# EAGLE design iotchair_nano-shield (EAGLE 6.5.0)
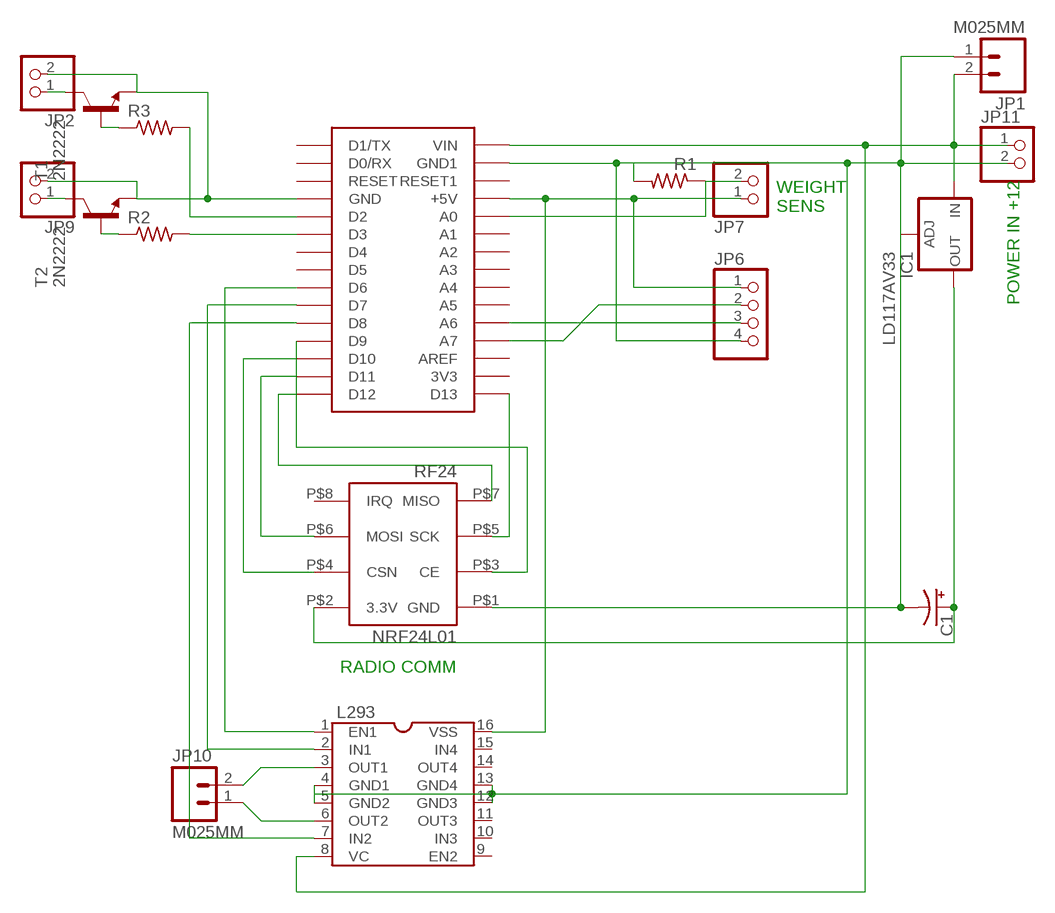
[diagram p0: schematic, sheet 1]

## Parts
C1  CPOL-USTT2D6L  [TT2D6L]
IC1  LD117AV33  [TO220L1]
JP1  M025MM  [SCREWTERMINAL-5MM-2]
JP2  PINHD-1X2  [1X02]
JP6  PINHD-1X4  [1X04]
JP7  PINHD-1X2  [1X02]
JP9  PINHD-1X2  [1X02]
JP10  M025MM  [SCREWTERMINAL-5MM-2]
JP11  PINHD-1X2  [1X02]
L293  DIL16  [DIL16]
NRF24L01  RF24  [4X2HEADER]
R1  R-US_0204/5  [0204/5]
R2  R-US_0204/5  [0204/5]
R3  R-US_0204/5  [0204/5]
T1  2N2222  [TO92-EBC-OVAL]
T2  2N2222  [TO92-EBC-OVAL]
U$1  ARDUINONANO  [PDIP-32]

## Nets
N$1: L293.2(IN1) U$1.D7
N$2: C1.+ IC1.2(OUT) NRF24L01.P$2(3.3V)
N$3: JP9.1 T2.C
N$4: JP6.3 U$1.A6
N$5: JP7.2 R1.1 U$1.A0
N$6: IC1.3(IN) JP1.2 JP11.1 L293.8(VC) U$1.VIN
N$7: JP6.2 U$1.A7
N$8: JP10.1 L293.6(OUT2)
N$18: NRF24L01.P$5(SCK) U$1.D13
N$19: NRF24L01.P$7(MISO) U$1.D12
N$20: NRF24L01.P$6(MOSI) U$1.D11
N$21: NRF24L01.P$4(CSN) U$1.D10
N$22: NRF24L01.P$3(CE) U$1.D9
N$24: L293.1(EN1) U$1.D6
N$25: C1.- IC1.1(ADJ) JP1.1 JP6.4 JP11.2 L293.4(GND1) L293.5(GND2) L293.12(GND3) L293.13(GND4) NRF24L01.P$1(GND) R1.2 U$1.GND1
N$26: R2.2 U$1.D3
N$27: L293.7(IN2) U$1.D8
N$28: R3.1 T1.B
N$29: JP2.1 T1.C
N$30: JP2.2 JP9.2 T1.E T2.E U$1.GND
N$31: R3.2 U$1.D2
N$33: JP6.1 JP7.1 L293.16(VSS) U$1.+5V
N$39: R2.1 T2.B
N$40: JP10.2 L293.3(OUT1)
Unconnected: L293.9(EN2) L293.10(IN3) L293.11(OUT3) L293.14(OUT4) L293.15(IN4) NRF24L01.P$8(IRQ) U$1.3V3 U$1.A1 U$1.A2 U$1.A3 U$1.A4 U$1.A5 U$1.AREF U$1.D0/RX U$1.D1/TX U$1.D4 U$1.D5 U$1.RESET U$1.RESET1

## Notes on the sheet
- WEIGHT
  SENS
- POWER IN +12
- RADIO COMM

## Library data of the parts
C1 = adafruit:CPOL-US: POLARIZED CAPACITOR, American symbol
IC1 = v-reg:LD117A?*: Low drop fixed and adjustable positive voltage regulators 1 A Source: http://www.st.com/stonline/products/literature/ds/7194/ld1117axx.pdf
JP1 JP10 = SparkFun-Connectors:M02: Standard 2-pin 0.1" header. Use with - straight break away headers ( PRT-00116) - right angle break away headers (PRT-00553) - swiss pins (PRT-00743) - machine pins (PRT-00117) - female headers (PRT-00115) Molex polarized connector foot print use with: PRT-08233 with associated crimp pins and housings. 2.54_SCREWTERM for use with PRT-10571. 3.5mm Screw Terminal footprints for PRT-08084 5mm Screw Terminal footprints for use with PRT-08432; STOREFRONT_ID: PRT-08432
JP2 JP7 JP9 JP11 = pinhead:PINHD-1X2: PIN HEADER
JP6 = pinhead:PINHD-1X4: PIN HEADER
L293 = l293:DIL16: Dual In Line / Socket
NRF24L01 = rf24:RF24
R1-R3 = adafruit:R-US_: RESISTOR, American symbol
T1 T2 = adafruit:2N2222: NPN TRANSISTOR Big oval pads
U$1 = jet-lib:ARDUINONANO

## Board
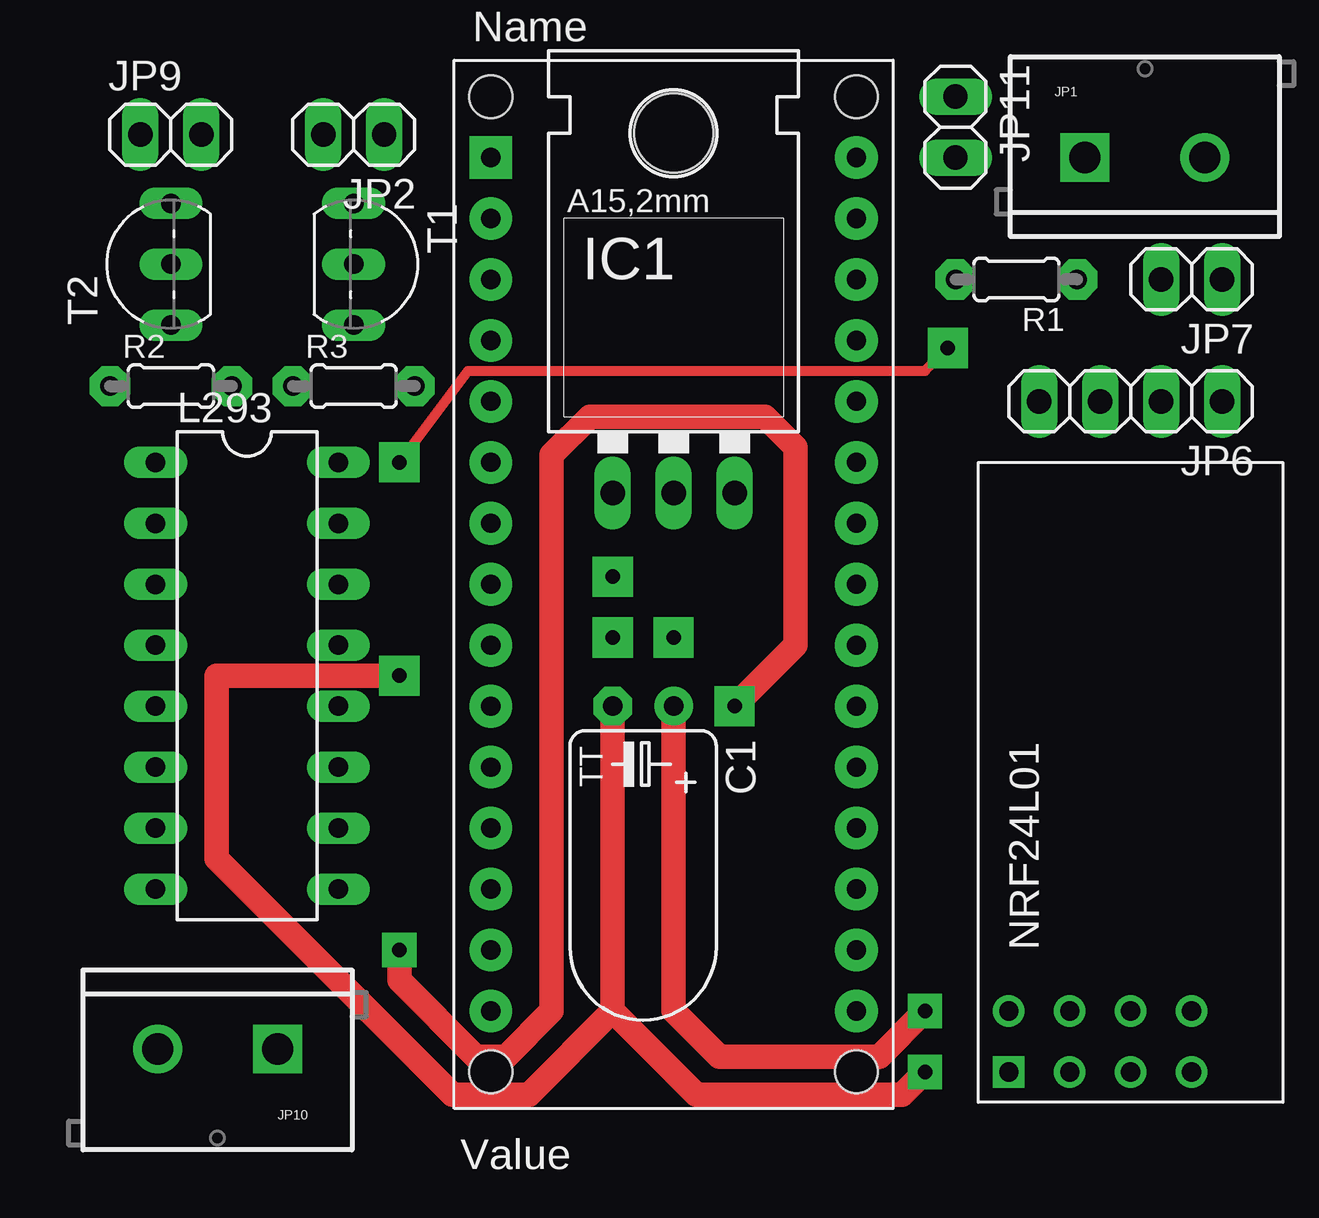
[diagram p1: board, top side]
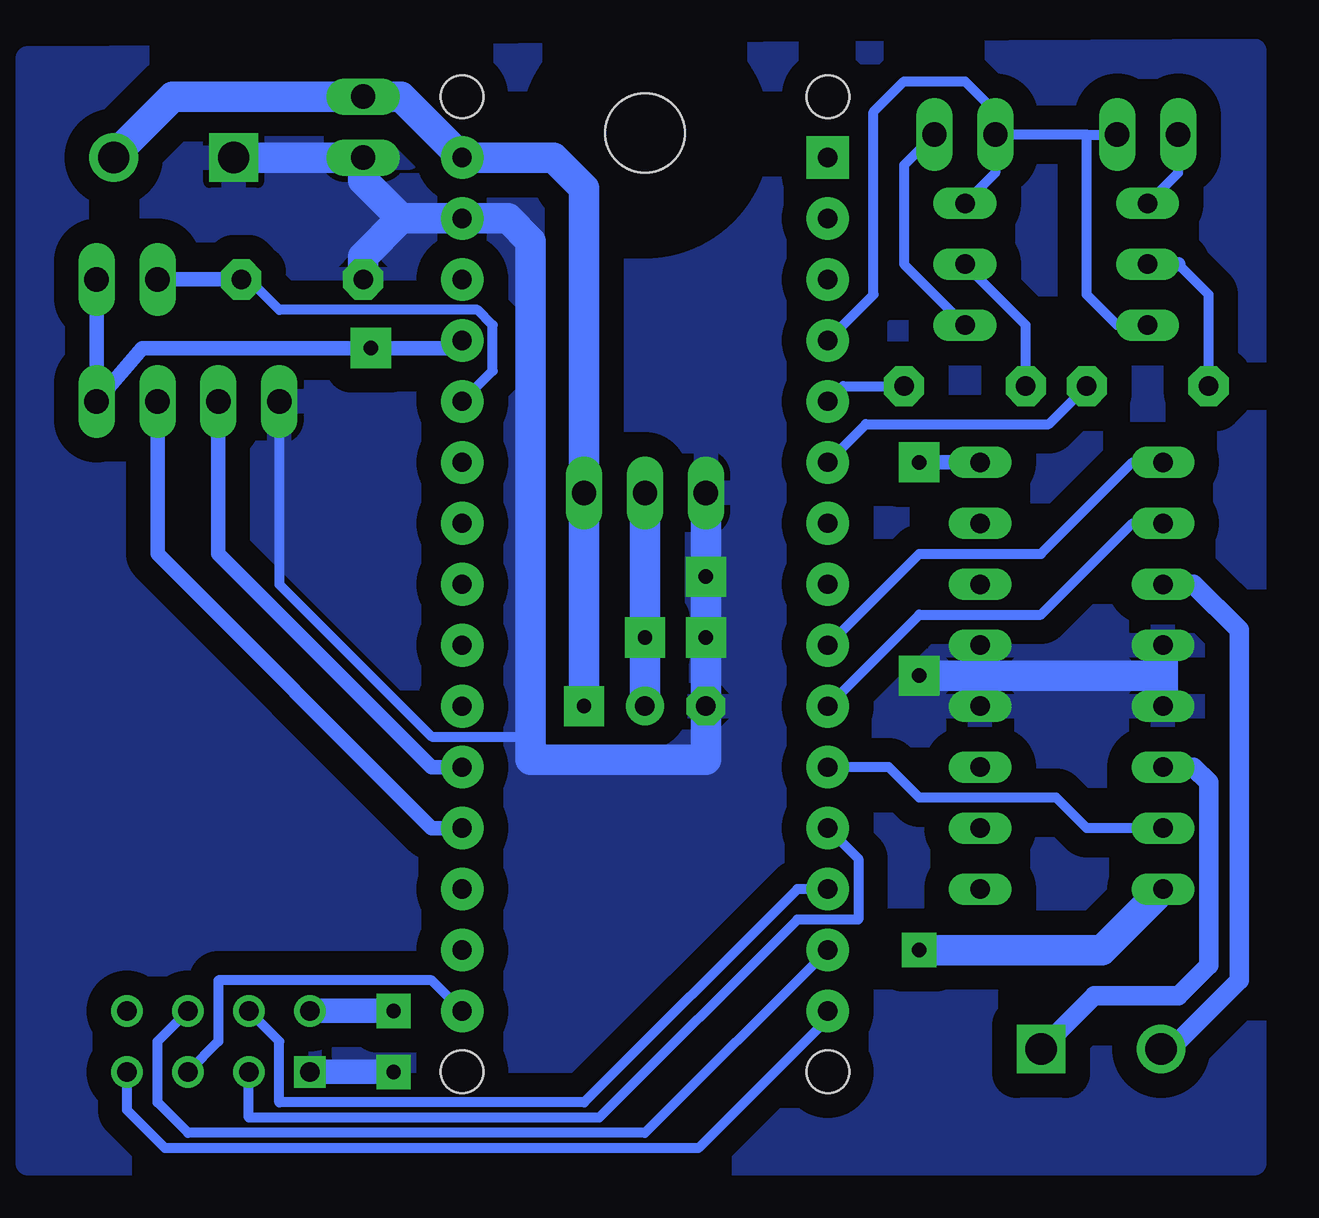
[diagram p2: board, bottom side, seen from below]

No outline drawn. Coordinates in mm, seen from the top.
Copper layers (1*16): Top 0.035mm / dielectric 1.5mm / Bottom 0.035mm
Design rules "default": minimum track width 10mil, minimum drill 24mil, track to track 8mil, track to pad 8mil, pad to pad 8mil, via to via 8mil, smd to smd 8mil, copper to edge 40mil, drill to drill 8mil, minimum pad ring 10mil, minimum via ring 8mil, stop-mask expansion 4mil, vias tented up to drill 0mil, thermal gap 10mil

### Footprints (pad centres in the part's own frame; a part is rotated, then mirrored left to right if it is on the bottom)
TT2D6L = drill 0.813 pad 1.6: + -1.27,0 | drill 0.813 pad 1.6 octagon: - 1.27,0
TO220L1 = drill 1.016 long: 1 -2.54,-3.81; 2 0,-3.81; 3 2.54,-3.81 | hole 3.302: 0,11.176
SCREWTERMINAL-5MM-2 = drill 1.3 pad 2.032 square: 1 0,0 | drill 1.3 pad 2.032: 2 5,0
1X02 = drill 1.016 long: 1 -1.27,0; 2 1.27,0
1X04 = drill 1.016 long: 1 -3.81,0; 2 -1.27,0; 3 1.27,0; 4 3.81,0
DIL16 = drill 0.813 long: 1 -8.89,-3.81; 2 -6.35,-3.81; 3 -3.81,-3.81; 4 -1.27,-3.81; 5 1.27,-3.81; 6 3.81,-3.81; 7 6.35,-3.81; 8 8.89,-3.81; 9 8.89,3.81; 10 6.35,3.81; 11 3.81,3.81; 12 1.27,3.81; 13 -1.27,3.81; 14 -3.81,3.81; 15 -6.35,3.81; 16 -8.89,3.81
4X2HEADER = drill 0.8 square: P$1 -1.27,3.81 | drill 0.8: P$2 1.27,3.81; P$3 -1.27,1.27; P$4 1.27,1.27; P$5 -1.27,-1.27; P$6 1.27,-1.27; P$7 -1.27,-3.81; P$8 1.27,-3.81
0204/5 = drill 0.813 pad 1.676 octagon: 1 -2.54,0; 2 2.54,0
TO92-EBC-OVAL = drill 0.813 long: B 0,-1.27; C 2.54,-1.27; E -2.54,-1.27
PDIP-32 = drill 0.8 pad 1.778: 3V3 15.24,-35.56; +5V 15.24,-10.16; A0 15.24,-12.7; A1 15.24,-15.24; A2 15.24,-17.78; A3 15.24,-20.32; A4 15.24,-22.86; A5 15.24,-25.4; A6 15.24,-27.94; A7 15.24,-30.48; AREF 15.24,-33.02; D0/RX 0,-5.08; D2 0,-12.7; D3 0,-15.24; D4 0,-17.78; D5 0,-20.32; D6 0,-22.86; D7 0,-25.4; D8 0,-27.94; D9 0,-30.48; D10 0,-33.02; D11 0,-35.56; D12 0,-38.1; D13 15.24,-38.1; GND 0,-10.16; GND1 15.24,-5.08; RESET 0,-7.62; RESET1 15.24,-7.62; VIN 15.24,-2.54 | drill 0.8 pad 1.778 square: D1/TX 0,-2.54 | hole 1.778: 0,0; 0,-40.64; 15.24,-40.64; 15.24,0

### Placement (x,y rotation side)
C1  24.13,19.05 180 top
IC1  25.4,31.75 0 top
JP1  42.55,41.91 0 top
JP2  12.06,42.86 180 top
JP6  44.45,31.75 180 top
JP7  46.99,36.83 180 top
JP9  4.45,42.86 0 top
JP10  8.89,4.76 180 top
JP11  37.15,43.18 270 top
L293  7.62,20.32 270 top
NRF24L01  43.18,5.08 90 top
R1  39.69,36.83 180 top
R2  4.45,32.38 0 top
R3  12.06,32.38 0 top
T1  13.34,37.47 270 top
T2  3.17,37.47 90 top
U$1  17.78,44.45 0 top

### Tracks (layer width: path | path; a pad name or v marks a point on that pad's centre or on a via)
N$1
  Bottom 0.406: U$1.D7 13.97,22.86 8.89,22.86 5.08,26.67 L293.2
N$2  (via drill 0.6, 0.6 pad 1.42, 0.6 pad 1.68)
  Top 1.016: C1.+ 25.4,6.35 27.3,4.45 33.97,4.45 v35.88,6.35
  Bottom 1.016: v35.88,6.35 NRF24L01.P$2
  Bottom 1.27: IC1.2 v25.4,21.91 C1.+
  other vias: 25.4,19.05
N$3
  Bottom 0.406: T2.C 3.17,41.27 JP9.1
N$4
  Bottom 0.61: U$1.A6 34.29,16.51 43.18,25.4 JP6.3
N$5
  Bottom 0.254: 41.91,36.83 R1.1
  Bottom 0.406: U$1.A0 31.75,33.02 31.75,34.92 32.38,35.56 40.64,35.56 41.91,36.83
  Bottom 0.61: R1.1 JP7.2
N$6  (via drill 0.6 pad 1.42, 0.6 pad 1.68)
  Top 1.016: v27.94,19.05 30.48,21.59 30.48,29.84 29.21,31.11 21.91,31.11 20.32,29.53 20.32,6.35 18.41,4.45 17.14,4.45 13.97,7.62 v13.97,8.89
  Bottom 1.27: JP1.2 47.55,41.99 45.09,44.45 JP11.1 35.56,44.45 U$1.VIN 29.21,41.91 27.94,40.64 IC1.3 v27.94,19.05 | L293.8 6.35,8.89 v13.97,8.89
N$7
  Bottom 0.61: U$1.A7 34.29,13.97 45.72,25.4 JP6.2
N$8
  Bottom 0.813: JP10.1 6.67,6.99 3.17,6.99 1.91,8.26 1.91,15.88 2.54,16.51 L293.6
N$18
  Bottom 0.406: NRF24L01.P$5 43.18,5.08 43.18,7.62 34.29,7.62 U$1.D13
N$19
  Bottom 0.406: U$1.D12 17.78,6.03 23.18,0.64 45.4,0.64 46.99,2.22 NRF24L01.P$7
N$20
  Bottom 0.406: NRF24L01.P$6 45.72,5.08 45.72,2.54 44.45,1.27 25.4,1.27 U$1.D11
N$21
  Bottom 0.406: NRF24L01.P$4 40.64,5.08 40.64,2.54 27.94,2.54 19.05,11.43 U$1.D10
N$22
  Bottom 0.406: NRF24L01.P$3 41.91,1.91 27.3,1.91 19.05,10.16 16.51,10.16 16.51,12.7 U$1.D9
N$24
  Bottom 0.406: U$1.D6 13.97,25.4 8.89,25.4 5.08,29.21 L293.1
N$25  (via drill 0.6, 0.6 pad 1.42, 0.6 pad 1.68)
  Top 1.016: C1.- 22.86,6.35 | v35.88,3.81 34.92,2.86 26.35,2.86 22.86,6.35 | 22.86,6.35 19.37,2.86 16.19,2.86 6.35,12.7 6.35,20.32 v13.97,20.32
  Bottom 0.406: JP6.4 40.64,24.13 34.29,17.78 30.16,17.78
  Bottom 1.016: IC1.1 v22.86,24.45 v22.86,21.91 | v35.88,3.81 NRF24L01.P$1
  Bottom 1.27: JP1.1 JP11.2 37.15,40.96 35.56,39.37 | R1.2 37.15,37.78 35.56,39.37 | 35.56,39.37 U$1.GND1 31.11,39.37 30.16,38.42 30.16,17.78 30.16,16.83 22.86,16.83 C1.- IC1.1 | 3.81,20.32 L293.5 | L293.4 3.81,20.32 | 3.81,20.32 v13.97,20.32 12.7,20.32 | L293.13 L293.12
  other vias: 22.86,19.05
  pour Bottom (isolate 1.016): 0,0 51.12,0 51.12,46.04 0,46.35
N$26
  Bottom 0.406: R2.2 8.57,30.8 16.19,30.8 U$1.D3
N$27
  Bottom 0.406: L293.7 6.99,13.97 8.26,15.24 13.97,15.24 15.24,16.51 U$1.D8
N$28
  Bottom 0.406: T1.B 9.53,34.92 R3.1
N$29
  Bottom 0.406: T1.C 14.61,37.47 14.61,41.59 JP2.1
N$30
  Bottom 0.406: T2.E 5.71,34.92 6.99,36.2 6.99,42.86 | 6.99,42.86 JP9.2 | 6.99,42.86 JP2.2 10.79,41.27 T1.E | 10.79,43.81 12.06,45.09 14.61,45.09 15.88,43.81 15.88,36.2 U$1.GND
  Bottom 0.61: 10.79,43.81 JP2.2
N$31
  Bottom 0.406: U$1.D2 17.14,32.38 R3.2
N$33  (via drill 0.6 pad 1.68)
  Top 0.406: v13.97,29.21 16.83,33.02 35.88,33.02 v36.83,33.97
  Bottom 0.61: JP7.1 JP6.1 46.35,33.97 v36.83,33.97 33.34,33.97 U$1.+5V | v13.97,29.21 L293.16
N$39
  Bottom 0.406: R2.1 1.91,36.2 3.17,37.47
  Bottom 0.61: 3.17,37.47 T2.B
N$40
  Bottom 0.813: L293.3 2.54,24.13 0.64,22.23 0.64,7.62 3.49,4.76 JP10.2